# Altium schematic sheet RF.SchDoc
size A3
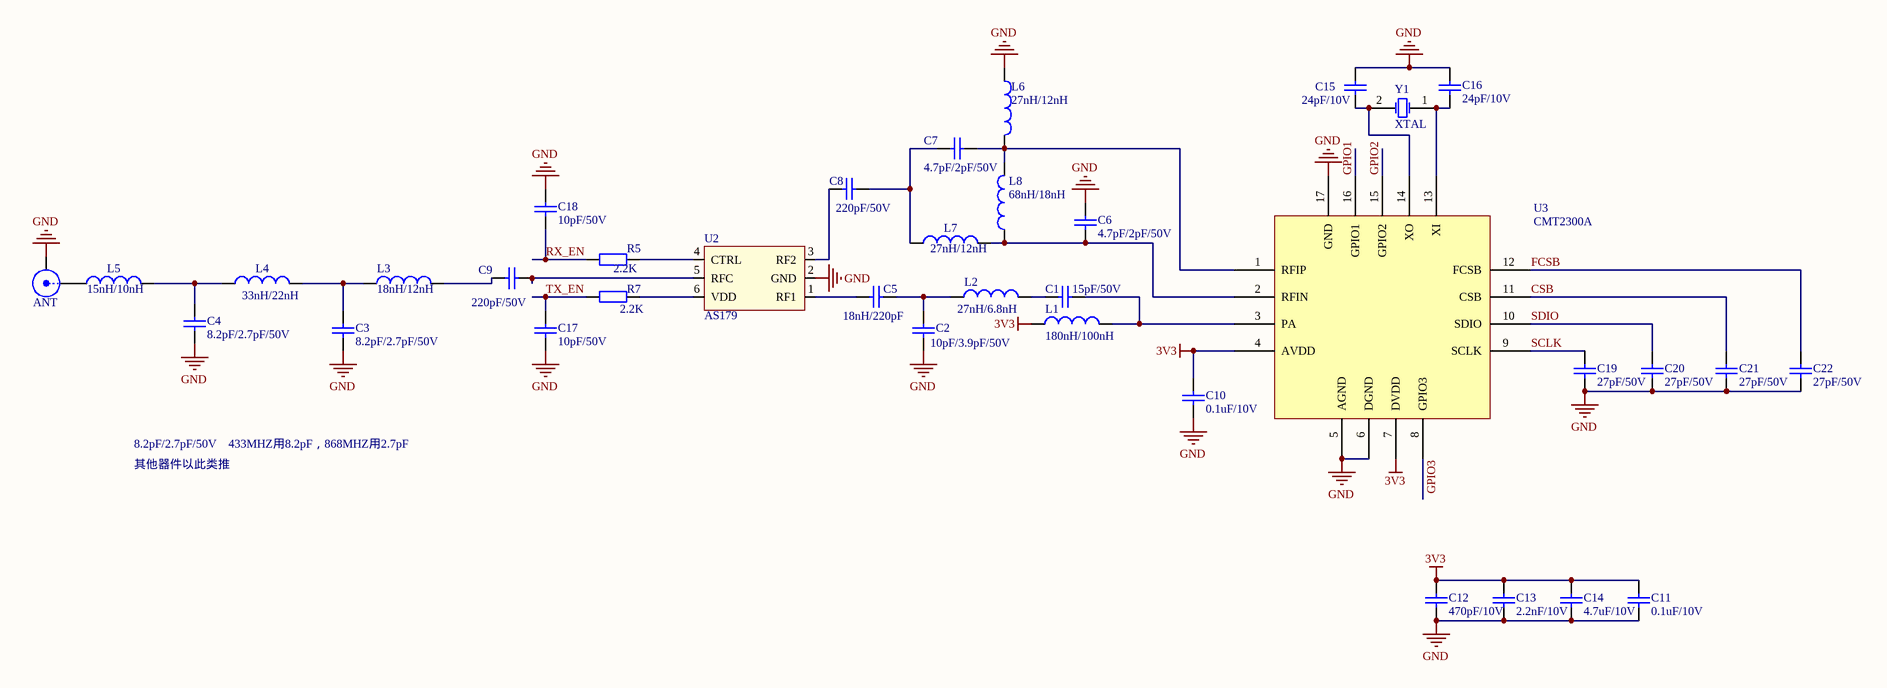
[diagram p0: RF.SchDoc]

## Parts
ANT  (no value)  [SMA Straight SMD]
C1  15pF/50V  [0603C]
C2  10pF/3.9pF/50V  [0603C]
C3  8.2pF/2.7pF/50V  [0603C]
C4  8.2pF/2.7pF/50V  [0603C]
C5  18nH/220pF  [0603C]
C6  4.7pF/2pF/50V  [0603C]
C7  4.7pF/2pF/50V  [0603C]
C8  220pF/50V  [0603C]
C9  220pF/50V  [0603C]
C10  0.1uF/10V  [0603C]
C11  0.1uF/10V  [0603C]
C12  470pF/10V  [0603C]
C13  2.2nF/10V  [0603C]
C14  4.7uF/10V  [0603C]
C15  24pF/10V  [0603C]
C16  24pF/10V  [0603C]
C17  10pF/50V  [0603C]
C18  10pF/50V  [0603C]
C19  27pF/50V  [0603C]
C20  27pF/50V  [0603C]
C21  27pF/50V  [0603C]
C22  27pF/50V  [0603C]
L1  180nH/100nH  [0603R]
L2  27nH/6.8nH  [0603R]
L3  18nH/12nH  [0603R]
L4  33nH/22nH  [0603R]
L5  15nH/10nH  [0603R]
L6  27nH/12nH  [0603R]
L7  27nH/12nH  [0603R]
L8  68nH/18nH  [0603R]
R5  2.2K  [0603R]
R7  2.2K  [0603R]
U2  AS179
U3  CMT2300A
Y1  XTAL  [BCY-W2/D3.1]

## Nets
3V3: C10.1 C11.1 C12.1 C13.1 C14.1 L1.1 U3.4(AVDD) U3.7(DVDD)
GND: ANT.2(GND) C2.1 C3.2 C4.2 C6.2 C10.2 C11.2 C12.2 C13.2 C14.2 C15.1 C16.1 C17.1 C18.2 C19.2 C20.2 C21.2 C22.2 L6.1 U2.2(GND) U3.5(AGND) U3.6(DGND) U3.17(GND)
CSB: C21.1 U3.11(CSB)
FCSB: C22.1 U3.12(FCSB)
GPIO1: U3.16(GPIO1)
GPIO2: U3.15(GPIO2)
GPIO3: U3.8(GPIO3)
RX_EN: C18.1 R5.2
SCLK: C19.1 U3.9(SCLK)
SDIO: C20.1 U3.10(SDIO)
TX_EN: C17.2 R7.2
NetANT_1: ANT.1(Signal) L5.1
NetC1_1: C1.1 L2.2
NetC1_2: C1.2 L1.2 U3.3(PA)
NetC2_2: C2.2 C5.2 L2.1
NetC3_1: C3.1 L3.1 L4.2
NetC4_1: C4.1 L4.1 L5.2
NetC5_1: C5.1 U2.1(RF1)
NetC6_1: C6.1 L7.2 L8.1 U3.2(RFIN)
NetC7_1: C7.1 C8.2 L7.1
NetC7_2: C7.2 L6.2 L8.2 U3.1(RFIP)
NetC8_1: C8.1 U2.3(RF2)
NetC9_1: C9.1 U2.5(RFC)
NetC9_2: C9.2 L3.2
NetC15_2: C15.2 U3.14(XO) Y1.2(OSC2)
NetC16_2: C16.2 U3.13(XI) Y1.1(OSC1)
NetR5_1: R5.1 U2.4(CTRL)
NetR7_1: R7.1 U2.6(VDD)

## Notes on the sheet
- 8.2pF/2.7pF/50V    433MHZ用8.2pF，868MHZ用2.7pF
- 其他器件以此类推

## Library data of the parts
ANT = SMA: SMA Straight Connector; LatestRevisionDate: 05-oct-2007  -  Semtech; LatestRevisionNote: Re-released for DXP Platform.; Publisher: Altium Limited
C1-C22 = Cap: Capacitor; Value: 106; Published: 8-Jun-2000; LatestRevisionDate: 17-Jul-2002; LatestRevisionNote: Re-released for DXP Platform.; PackageReference: RAD-0.3; Publisher: Altium Limited
L1-L8 = Inductor: Code_IEC: 1005; Value: 10mH; Published: 8-Jun-2000; LatestRevisionDate: 29-May-2009; LatestRevisionNote: IPC-7351 Footprint Added.; PackageReference: 0402-A; Publisher: Altium Limited; PackageDescription: Chip Inductor; Code_JEITA: 0402
R5 R7 = Res2: Resistor; Value: 10K/5%/1/8W; Published: 8-Jun-2000; LatestRevisionDate: 17-Jul-2002; LatestRevisionNote: Re-released for DXP Platform.; PackageReference: AXIAL-0.4; Publisher: Altium Limited
U2 = PE4259 RF Switch: PE4259 Peregrine RF Switch; LatestRevisionDate: 03-Sep-2012 -  Semtech; Value: PE4259
Y1 = XTAL: Crystal Oscillator; Published: 8-Jun-2000; LatestRevisionDate: 17-Jul-2002; LatestRevisionNote: Re-released for DXP Platform.; PackageReference: R38; Publisher: Altium Limited